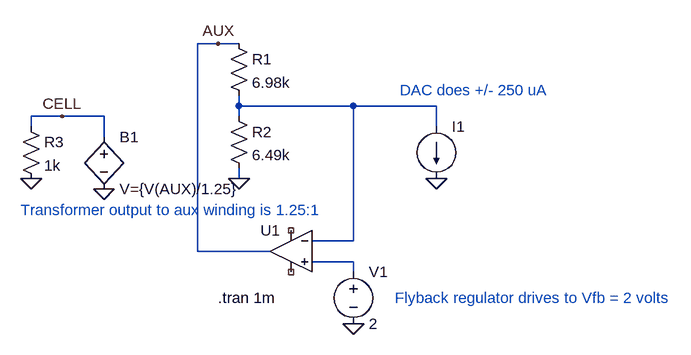
[diagram p0: schematic tester-flyback-feedback.asc]
tester-flyback-feedback.asc, the LTspice schematic file:
Version 4.1
SHEET 1 880 680
WIRE 64 80 32 80
WIRE 96 80 64 80
WIRE 96 176 96 160
WIRE 272 176 96 176
WIRE 400 176 272 176
WIRE -176 192 -224 192
WIRE -112 192 -176 192
WIRE 96 192 96 176
WIRE -224 208 -224 192
WIRE 400 208 400 176
WIRE -112 224 -112 192
WIRE 96 288 96 272
WIRE 272 384 272 176
WIRE 272 384 208 384
WIRE 32 400 32 80
WIRE 144 400 32 400
WIRE 272 416 208 416
WIRE 272 432 272 416
FLAG 272 512 0
FLAG 96 288 0
FLAG 64 80 AUX
FLAG -112 304 0
FLAG -224 288 0
FLAG -176 192 CELL
FLAG 400 288 0
SYMBOL res 80 64 R0
SYMATTR InstName R1
SYMATTR Value 6.98k
SYMBOL res 80 176 R0
SYMATTR InstName R2
SYMATTR Value 6.49k
SYMBOL voltage 272 416 R0
WINDOW 123 0 0 Left 0
WINDOW 39 0 0 Left 0
SYMATTR InstName V1
SYMATTR Value 2
SYMBOL OpAmps\\UniversalOpAmp 176 400 M0
SYMATTR InstName U1
SYMBOL bv -112 208 R0
SYMATTR InstName B1
SYMATTR Value V={V(AUX)/1.25}
SYMBOL res -240 192 R0
SYMATTR InstName R3
SYMATTR Value 1k
SYMBOL current 400 208 R0
WINDOW 3 24 80 Invisible 2
WINDOW 123 0 0 Left 0
WINDOW 39 0 0 Left 0
SYMATTR InstName I1
SYMATTR Value PWL(0 0 100u 0 101u 250u 200u 250u 201u -250u 300u -250u 301u 0)
TEXT 64 472 Left 2 !.tran 1m
TEXT 344 152 Left 2 ;DAC does +/- 250 uA
TEXT -240 336 Left 2 ;Transformer output to aux winding is 1.25:1
TEXT 336 472 Left 2 ;Flyback regulator drives to Vfb = 2 volts

The netlist it stands for:
* tester-flyback-feedback.asc
R1 AUX N001 6.98k
R2 N001 0 6.49k
V1 N002 0 2
X§U1 N002 N001 NC_01 NC_02 AUX level1 Avol=1Meg GBW=10Meg Vos=0 En=0 Enk=0 In=0 Ink=0 Rin=500Meg  ; pins In+ In- V+ V- OUT
B1 CELL 0 V={V(AUX)/1.25}
R3 CELL 0 1k
I1 N001 0 PWL(0 0 100u 0 101u 250u 200u 250u 201u -250u 300u -250u 301u 0)
.tran 1m
* DAC does +/- 250 uA
* Transformer output to aux winding is 1.25:1
* Flyback regulator drives to Vfb = 2 volts
.lib UniversalOpAmp1.lib
.backanno
.end